# EAGLE design arduino_shield_v2 (EAGLE 9.6.2)
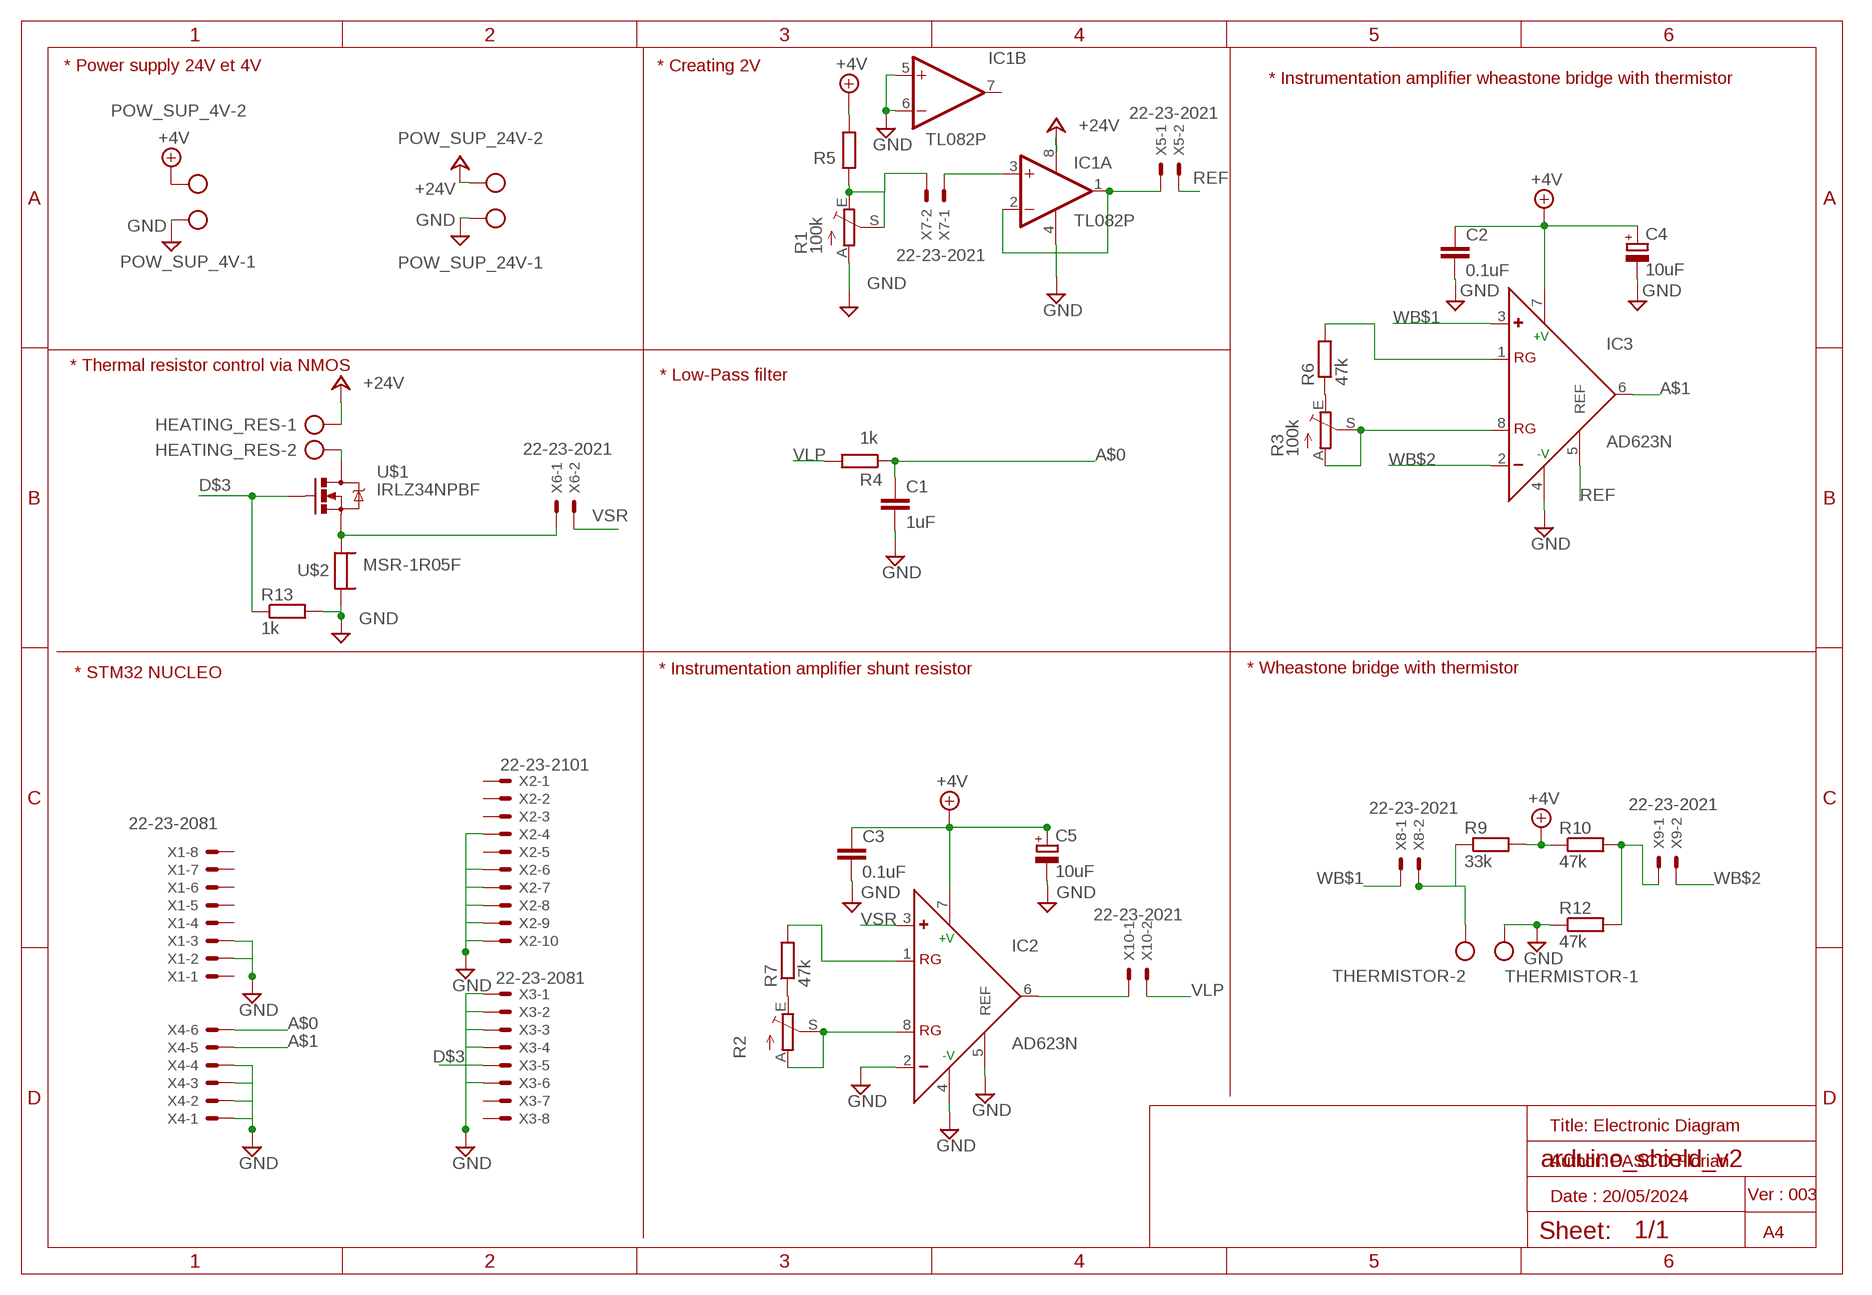
[diagram p0: schematic, sheet 1]

## Parts
C1  1uF  C-EU050-025X075  [C050-025X075]
C2  0.1uF  C-EU050-025X075  [C050-025X075]
C3  0.1uF  C-EU050-025X075  [C050-025X075]
C4  10uF  CPOL-EUE5-5  [E5-5]
C5  10uF  CPOL-EUE5-5  [E5-5]
HEATING_RES  AK300/2  [AK300/2]
IC1  TL082P  [DIL08]
IC2  AD623N  [DIL08]
IC3  AD623N  [DIL08]
POW_SUP_4V  AK300/2  [AK300/2]
POW_SUP_24V  AK300/2  [AK300/2]
R1  100k  TRIM_EU-S64W  [S64W]
R2  TRIM_EU-S64W  [S64W]
R3  100k  TRIM_EU-S64W  [S64W]
R4  1k  R-EU_0207/10  [0207/10]
R5  47k  R-EU_0207/10  [0207/10]
R6  47k  R-EU_0207/10  [0207/10]
R7  47k  R-EU_0207/10  [0207/10]
R9  33k  R-EU_0207/10  [0207/10]
R10  47k  R-EU_0207/10  [0207/10]
R12  47k  R-EU_0207/10  [0207/10]
R13  1k  R-EU_0207/10  [0207/10]
THERMISTOR  AK300/2  [AK300/2]
U$1  IRLZ34NPBF  [TO-220(2)]
U$2  MSR-1R05F  [MSR1]
X1  22-23-2081  [22-23-2081]
X2  22-23-2101  [22-23-2101]
X3  22-23-2081  [22-23-2081]
X4  22-23-2061  [22-23-2061]
X5  22-23-2021  [22-23-2021]
X6  22-23-2021  [22-23-2021]
X7  22-23-2021  [22-23-2021]
X8  22-23-2021  [22-23-2021]
X9  22-23-2021  [22-23-2021]
X10  22-23-2021  [22-23-2021]

## Nets
+4.1V: C2.1 C3.1 C4.+ C5.+ IC2.7(+V) IC3.7(+V) POW_SUP_4V.2 R5.2 R9.2 R10.1 ; supply symbol labelled +4V
+24V: HEATING_RES.1 IC1.8(P:V+) POW_SUP_24V.2
A$0: C1.1 R4.1 X4.6
A$1: IC3.6(OUT) X4.5
D$3: R13.1 U$1.IN(G) X3.5
GND: C1.2 C2.2 C3.2 C4.- C5.- IC1.4(P:V-) IC1.5(B:+IN) IC1.6(B:-IN) IC2.2(-) IC2.4(-V) IC2.5(REF) IC3.4(-V) POW_SUP_4V.1 POW_SUP_24V.1 R1.A R12.1 R13.2 THERMISTOR.1 U$2.P$2 X1.2 X1.3 X2.4 X2.6 X2.7 X2.8 X2.9 X2.10 X3.1 X3.2 X3.3 X3.4 X3.6 X4.1 X4.2 X4.3 X4.4
N$1: R1.E R1.S R5.1 X7.2
N$2: R2.E R7.1
N$3: IC3.1(RG) R6.2
N$4: IC3.8(RG) R3.A R3.S
N$5: IC2.8(RG) R2.A R2.S
N$6: R3.E R6.1
N$7: IC2.1(RG) R7.2
N$8: IC1.3(A:+IN) X7.1
N$9: IC2.6(OUT) X10.1
N$10: HEATING_RES.2 U$1.GND(D)
N$11: R10.2 R12.2 X9.1
N$12: R9.1 THERMISTOR.2 X8.2
N$13: IC1.1(A:OUT) IC1.2(A:-IN) X5.1
N$14: U$1.OUT(S) U$2.P$1 X6.1
REF: IC3.5(REF) X5.2
VLP: R4.2 X10.2
VSR: IC2.3(+) X6.2
WB$1: IC3.3(+) X8.1
WB$2: IC3.2(-) X9.2
Unconnected: IC1.7(B:OUT) X1.1 X1.4 X1.5 X1.6 X1.7 X1.8 X2.1 X2.2 X2.3 X2.5 X3.7 X3.8

## Notes on the sheet
- * Power supply 24V et 4V | * Creating 2V
- * Instrumentation amplifier wheastone bridge with thermistor
- * Thermal resistor control via NMOS
- * Low-Pass filter
- * STM32 NUCLEO | * Instrumentation amplifier shunt resistor | * Wheastone bridge with thermistor
- Title: Electronic Diagram
- Author: PASCO Florian
- Date : 20/05/2024 | Ver : 003
- A4

## Library data of the parts
C1-C3 = rcl:C-EU: CAPACITOR, European symbol; SPICEPREFIX: C
C4 C5 = rcl:CPOL-EU: POLARIZED CAPACITOR, European symbol; SPICEPREFIX: C
HEATING_RES POW_SUP_4V POW_SUP_24V THERMISTOR = con-ptr500:AK300/2: CONNECTOR; OC_FARNELL: unknown; OC_NEWARK: unknown
IC1 = linear:TL082: OP AMP Data sheet <http://www.ti.com/lit/ds/symlink/tl084a . pdf>; DATA_SHEET: <a href="http://www.ti.com/lit/ds/symlink/tl084a.pdf"> Data sheet </a>
IC2 IC3 = analog-devices:AD623: Single-Supply, Rail-to-Rail, Low Cost Instrumentation Amplifier Source: http://www.analog.com/static/imported-files/data_sheets/AD623.pdf; MF: ALTERA CORPORATION; MPN: AD623ANZ; OC_FARNELL: 9603700; OC_NEWARK: 59K4402
R1-R3 = pot:TRIM_EU-: POTENTIOMETER
R4-R7 R9 R10 R12 R13 = rcl:R-EU_: RESISTOR, European symbol; SPICEPREFIX: R
U$1 = IRLZ34NPBF:IRLZ34NPBF: Check availability <https://pricing.snapeda.com/parts/IRLZ34NPBF/Infineon/view-part?ref=eda>; AVAILABILITY: In Stock; CHECK_PRICES: https://www.snapeda.com/parts/IRLZ34NPBF/Infineon+Technologies/view-part/?ref=eda; DESCRIPTION: MOSFET, Power,N-Ch,VDSS 55V,RDS(ON) 0.035Ohm,ID 30A,TO-220AB,PD 68W,VGS +/-16V | Infineon IRLZ34NPBF; MF: Infineon; MP: IRLZ34NPBF; PACKAGE: TO-220 Infineon; PRICE: None; PURCHASE-URL: https://www.snapeda.com/api/url_track_click_mouser/?unipart_id=219&manufacturer=Infineon&part_name=IRLZ34NPBF&search_term=None; SNAPEDA_LINK: https://www.snapeda.com/parts/IRLZ34NPBF/Infineon+Technologies/view-part/?ref=snap
U$2 = MSR-1R05F:MSR-1R05F
X1 X3 = con-molex:22-23-2081: .100" (2.54mm) Center Header - 8 Pin; MF: MOLEX; MPN: 22-23-2081; OC_FARNELL: 1756826; OC_NEWARK: 01C7592
X2 = con-molex:22-23-2101: .100" (2.54mm) Center Header - 10 Pin; MF: MOLEX; MPN: 22-23-2101; OC_FARNELL: 1756828; OC_NEWARK: 94C0765
X4 = con-molex:22-23-2061: .100" (2.54mm) Center Header - 6 Pin; MF: MOLEX; MPN: 22-23-2061; OC_FARNELL: 1462922; OC_NEWARK: 27C1933
X5-X10 = con-molex:22-23-2021: .100" (2.54mm) Center Header - 2 Pin; MF: MOLEX; MPN: 22-23-2021; OC_FARNELL: 1462926; OC_NEWARK: 25C3832

## Board
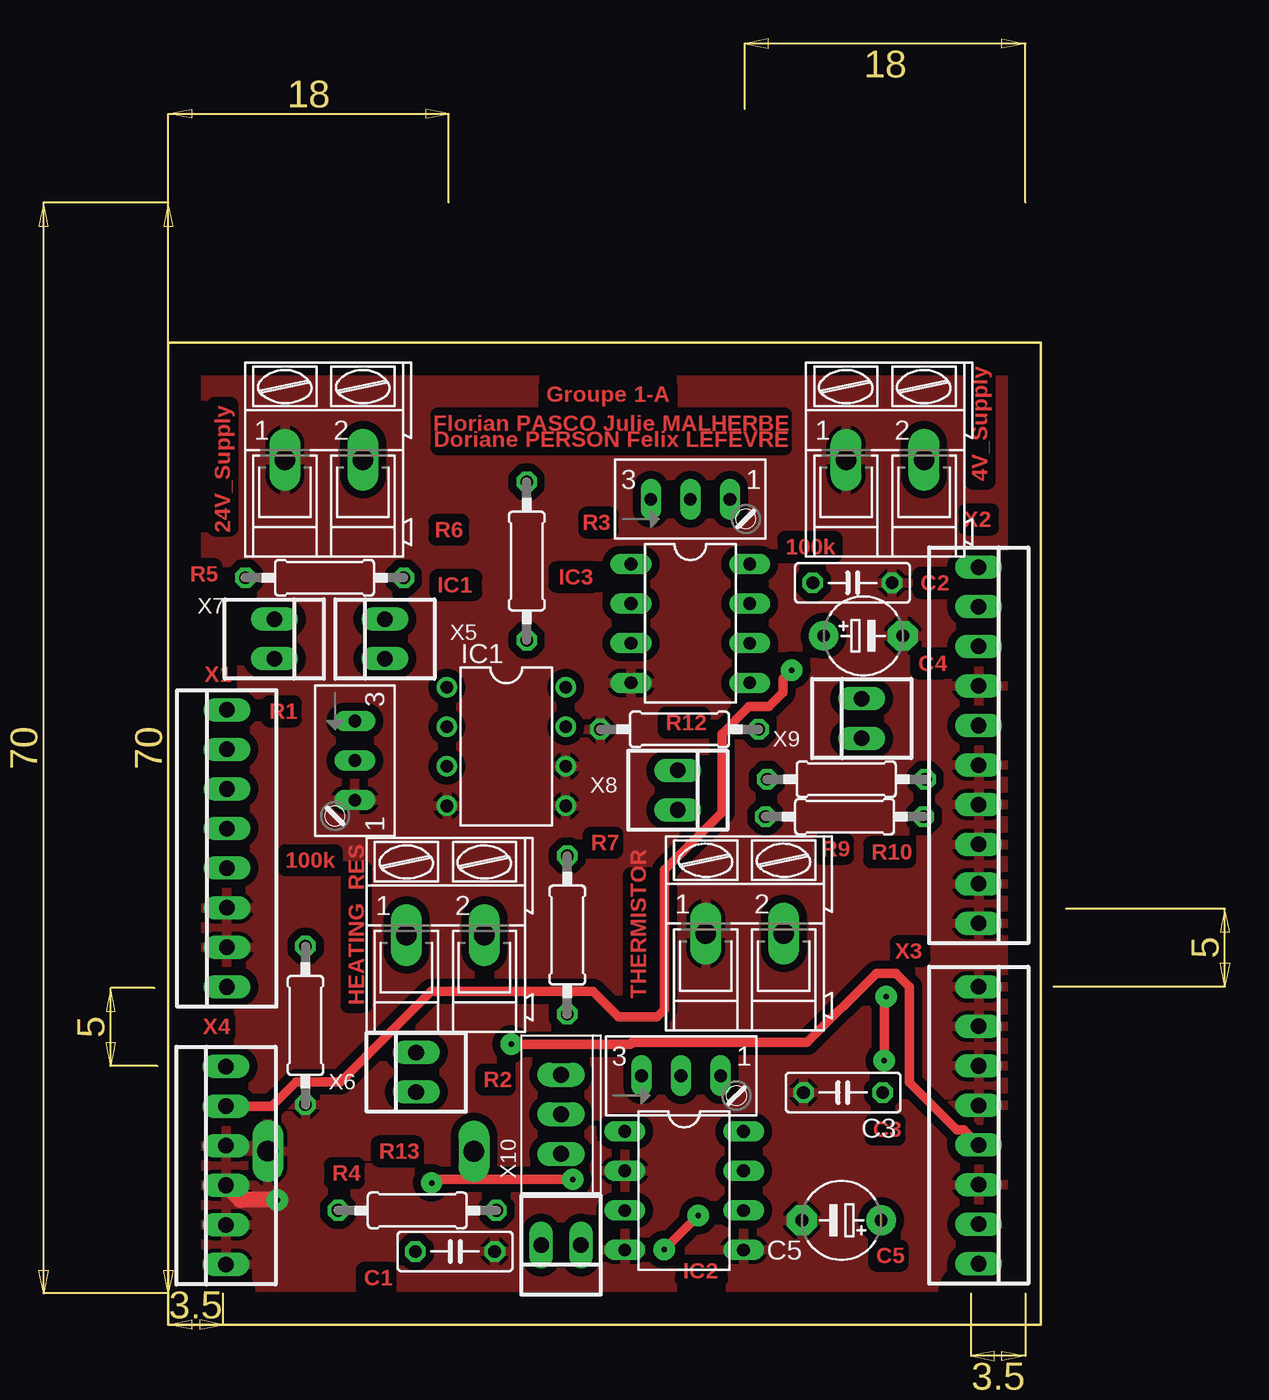
[diagram p1: board, top side]
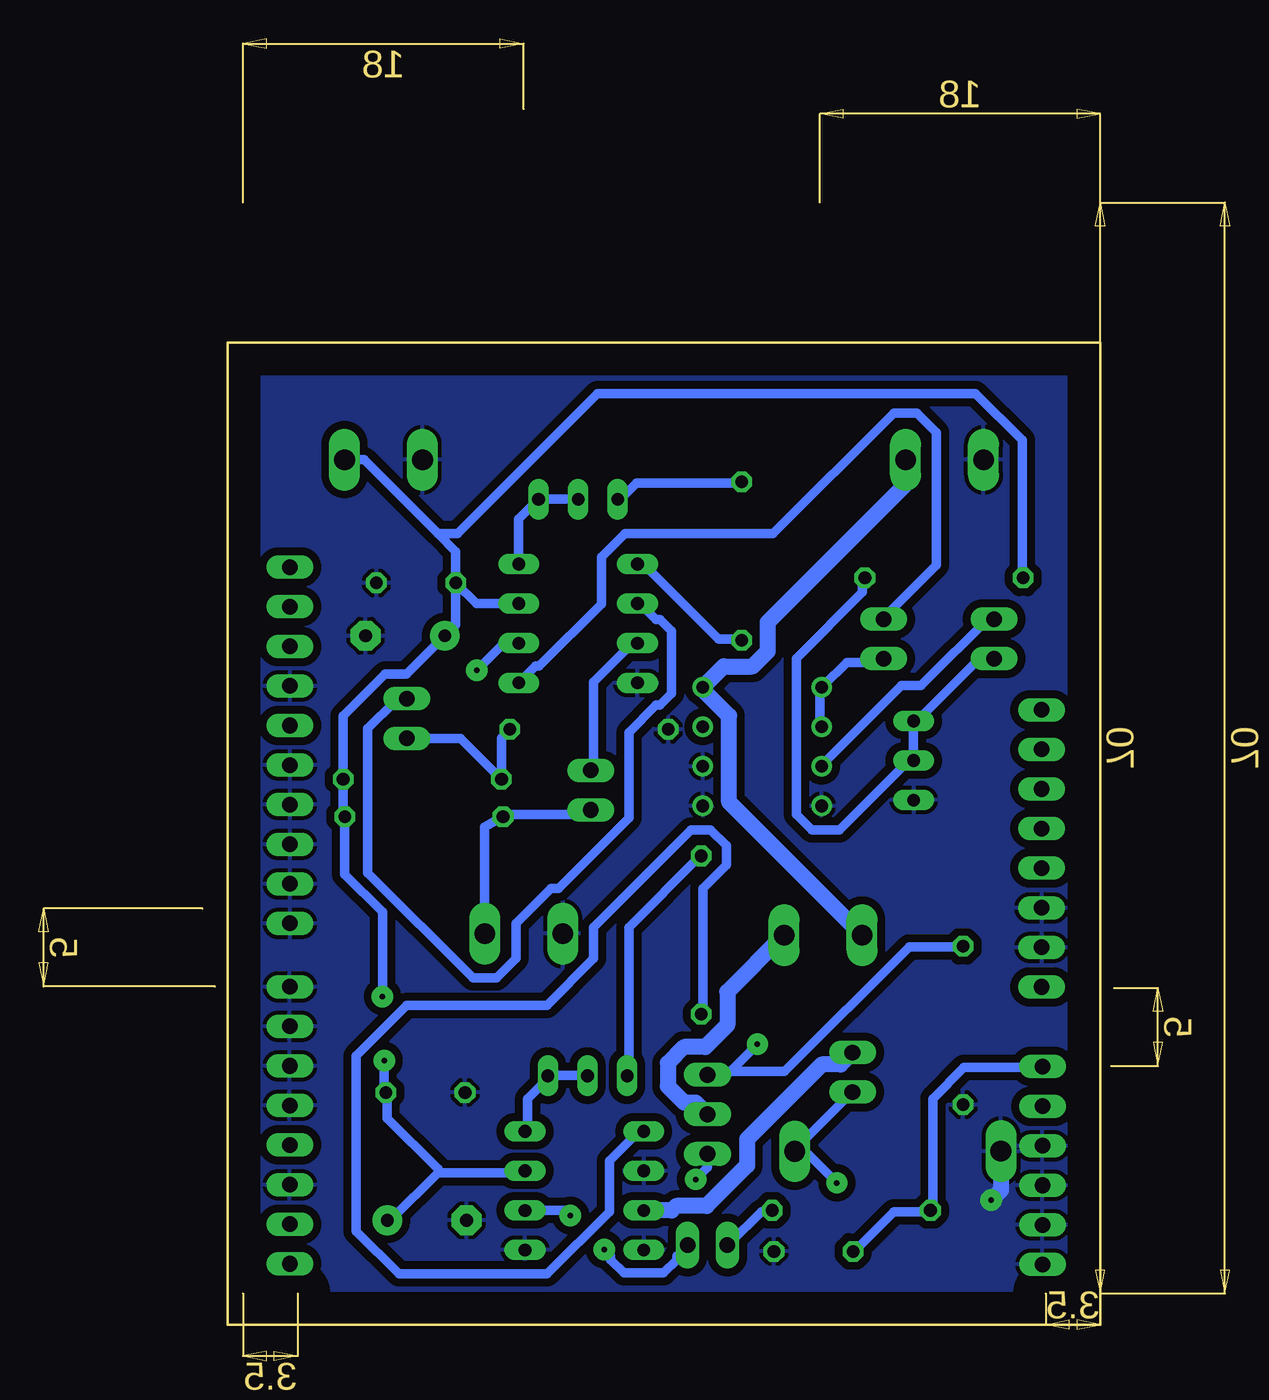
[diagram p2: board, bottom side, seen from below]

Size 56 x 63 mm. Coordinates in mm from the lower left corner, seen from the top.
Outline: 0,0 0,63 56,63 56,0 0,0
Copper layers (1*16): Top 0.035mm / dielectric 1.5mm / Bottom 0.035mm
Design rules "LBMS-ENIB": minimum track width 24mil, minimum drill 10mil, track to track 20mil, track to pad 20mil, pad to pad 20mil, via to via 20mil, smd to smd 8mil, copper to edge 80mil, drill to drill 8mil, minimum pad ring 10mil, minimum via ring 20mil, stop-mask expansion 4mil, vias tented up to drill 0mil, thermal gap 10mil

### Footprints (pad centres in the part's own frame; a part is rotated, then mirrored left to right if it is on the bottom)
C050-025X075 = drill 0.813 octagon: 1 -2.54,0; 2 2.54,0
E5-5 = drill 0.813 pad 1.905: + -2.54,0 | drill 0.813 pad 1.905 octagon: - 2.54,0
AK300/2 = drill 1.321 long: 1 -2.515,0; 2 2.489,0
DIL08 = drill 0.813 pad 1.27: 1 -3.81,-3.81; 2 -1.27,-3.81; 3 1.27,-3.81; 4 3.81,-3.81; 5 3.81,3.81; 6 1.27,3.81; 7 -1.27,3.81; 8 -3.81,3.81
DIL08' = drill 0.813 long: 1 -3.81,-3.81; 2 -1.27,-3.81; 3 1.27,-3.81; 4 3.81,-3.81; 5 3.81,3.81; 6 1.27,3.81; 7 -1.27,3.81; 8 -3.81,3.81
S64W = drill 0.813 long: A 2.54,1.27; E -2.54,1.27; S 0,1.27
0207/10 = drill 0.813 octagon: 1 -5.08,0; 2 5.08,0
TO-220(2) = drill 1.016 long: GND 0,0; IN -2.54,0; OUT 2.54,0
MSR1 = drill 1.321 long: P$1 -6.74,0; P$2 6.5,-0.01
22-23-2081 = drill 1 long: 1 -8.89,0; 2 -6.35,0; 3 -3.81,0; 4 -1.27,0; 5 1.27,0; 6 3.81,0; 7 6.35,0; 8 8.89,0
22-23-2101 = drill 1 long: 1 -11.43,0; 2 -8.89,0; 3 -6.35,0; 4 -3.81,0; 5 -1.27,0; 6 1.27,0; 7 3.81,0; 8 6.35,0; 9 8.89,0; 10 11.43,0
22-23-2061 = drill 1 long: 1 -6.35,0; 2 -3.81,0; 3 -1.27,0; 4 1.27,0; 5 3.81,0; 6 6.35,0
22-23-2021 = drill 1 long: 1 -1.27,0; 2 1.27,0

### Placement (x,y rotation side)
C1  18.4,4.7 0 top
C2  43.9,47.6 0 top
C3  43.3,14.9 180 top
C4  44.6,44.2 0 top
C5  43.2,6.7 180 top
HEATING_RES  17.8,25 0 top
IC1  21.69,37.1 270 top
IC2  AD623N  [DIL08']  33.1,8.6 270 top
IC3  AD623N  [DIL08']  33.5,45 270 top
POW_SUP_4V  46,55.5 0 top
POW_SUP_24V  10,55.5 0 top
R1  10.7,36.2 270 top
R2  32.9,14.7 0 top
R3  33.5,51.7 0 top
R4  15.98,7.34 0 top
R5  10.02,47.93 180 top
R6  23,49 270 top
R7  25.6,25 270 top
R9  43.4,32.6 0 top
R10  43.5,35 180 top
R12  32.8,38.2 0 top
R13  8.8,19.2 270 top
THERMISTOR  37,25.1 0 top
U$1  25.2,13.5 270 top
U$2  12.88,11.12 180 top
X1  3.75,30.56 90 top
X2  52,37.18 270 top
X3  52.01,12.8 270 top
X4  3.7,10.21 90 top
X5  13.9,44 90 top
X6  15.9,16.2 90 top
X7  6.8,44 270 top
X8  32.7,34.3 270 top
X9  44.5,38.9 90 top
X10  25.2,5.1 180 top

### Tracks (layer width: path | path; a pad name or v marks a point on that pad's centre or on a via)
+4.1V  (via drill 0.35)
  Top 0.61: v46.06,21.06 45.94,20.94 v45.94,16.94
  Bottom 0.61: 42.5,9.75 37,9.75 IC2.7 | 42.5,9.75 45.5,6.75 C5.+ | 45.75,14.75 45.75,13.25 42.5,10 42.5,9.75 | 45.75,14.75 C3.1 | R5.2 5,48 5,56.75 8,59.75 32.25,59.75 41.25,50.75 42.5,50.75 | POW_SUP_4V.2 47.25,55.5 42.5,50.75 | v46.06,21.06 46.06,26.48 48.48,28.9 R9.2 48.58,32.7 R10.1 48.58,39.06 45.9,41.74 44.52,41.74 C4.+ 41.36,44.9 C2.1 | v45.94,16.94 45.94,14.94 45.75,14.75 | C2.1 40.03,46.27 IC3.7 | C2.1 41.36,49.61 42.5,50.75
+24V
  Bottom 1.016: HEATING_RES.1 23.82,33.54 23.82,39.06 25.5,40.74 IC1.8 24.16,42.24 22.31,42.24 21.32,43.23 21.32,45.08 12.49,53.92 POW_SUP_24V.2
A$0
  Bottom 0.61: C1.1 15.75,4.75 13.25,7.25 11,7.25 R4.1 10.75,7.5 10.75,14.5 8.75,16.5 3.75,16.5 X4.6
A$1  (via drill 0.35)
  Top 0.61: v40,42 39.44,41.44 39.44,40.58 38.54,39.67 37.27,39.67 35.51,37.92 35.51,32.87 31.83,29.19 31.83,20.23 31.36,19.76 28.88,19.76 27.25,21.39 16.85,21.39 11.05,15.59 8.19,15.59 6.62,14.02 X4.5
  Bottom 0.61: IC3.6 38.27,43.73 v40,42
D$3  (via drill 0.35)
  Top 0.61: v22,18 29.65,18 29.75,18.1 40.99,18.1 45.44,22.55 46.68,22.55 47.55,21.68 47.55,15.55 50.6,12.5 51.03,12.5 X3.5
  Bottom 0.61: R13.1 9,24.25 12.25,24.25 20.25,16.25 25,16.25 U$1.IN 23.96,16.04 v22,18
GND  (via drill 0.35)
  Top 1.016: v7,8 4.64,8 X4.3
  Bottom 1.016: U$2.P$2 6.38,8.62 v7,8
  pour Top: 22.82,90.56 65.56,90.56 65.9,90.9 80.03,76.77 80.03,-7.38 59,-28.42 -13.07,-28.42 -32.52,-8.96 -32.52,74.86 -16.87,90.51 23.57,90.51
  pour Bottom: -5,-3 -5,67 60,67 60,-3
N$1
  Bottom 0.61: R5.1 15.25,47.75 15.25,47 19.5,42.75 19.5,32.75 18.5,31.75 16.75,31.75 12.25,36.25 R1.S 12,36.25 12,38.5 R1.E 11.75,38.75 8,42.5 7,42.5 X7.2
N$2
  Bottom 0.61: R2.E 30.25,16 30.25,25.5 25.75,30 R7.1
N$3
  Bottom 0.61: R6.2 23,44 24.5,44 29.5,49 IC3.1
N$4
  Bottom 0.61: R3.S R3.A 37.31,51.7 IC3.8
N$5
  Bottom 0.61: R2.S 33,16 35.25,16 R2.A 35.5,15.75 36.75,14.5 36.75,12.5 IC2.8
N$6
  Bottom 0.61: R6.1 23,54 29.75,54 30.75,53 R3.E
N$7
  Bottom 0.61: R7.2 25.5,20 25.5,28 24,29.5 24,30.75 25,31.75 26.25,31.75 32.5,25.5 32.5,23.5 35.5,20.5 44.5,20.5 47.75,17.25 47.75,6 45,3.25 35.5,3.25 31.5,7.25 31.5,10.5 29.5,12.5 IC2.1
N$8
  Bottom 0.61: IC1.3 17.75,36 12.75,41 11.5,41 7,45.5 X7.1
N$9  (via drill 0.35)
  Top 0.61: v34,7 v31.82,4.82
  Bottom 0.61: IC2.6 34.33,7.33 v34,7 | v31.82,4.82 31.42,4.42 31.42,4.18 30.56,3.32 28.02,3.32 27.16,4.18 27.16,4.41 X10.1
N$10
  Bottom 1.016: HEATING_RES.2 23.92,21.37 23.92,19.23 25.33,17.82 26.7,17.82 27.74,16.78 27.74,15.3 26.7,14.26 25.96,14.26 U$1.GND
N$11
  Bottom 0.61: X9.1 41.05,37.63 R10.2 38.42,37.66 R12.2
N$12
  Bottom 0.61: X8.2 32.75,33 33,32.75 38.25,32.75 R9.1 39.5,31.94 39.5,25.25 THERMISTOR.2
N$13
  Bottom 0.61: IC1.2 18,38.5 18,40.75 IC1.1 17.75,41 16.25,42.5 14,42.5 X5.1
N$14  (via drill 0.35)
  Top 0.61: v25.96,9.32 17.12,9.32 v16.9,9.1
  Bottom 0.61: X6.1 19.61,11.21 U$2.P$1 18.92,11.12 v16.9,9.1 | U$1.OUT 25.2,10.09 v25.96,9.32
REF
  Bottom 0.61: IC3.5 36.25,42.25 36,42.25 32,46.25 32,49.25 30.5,50.75 21,50.75 13.25,58.5 11.75,58.5 10.5,57.25 10.5,48.75 13.75,45.5 X5.2
VLP
  Bottom 0.61: R4.2 21.25,7.25 21.75,7.25 23.75,5.25 X10.2
VSR
  Bottom 1.016: X6.2 16.67,16.7 17.87,16.7 22.66,11.91 22.66,10.22 25.26,7.62 27.2,7.62 27.5,7.33 IC2.3
WB$1
  Bottom 0.61: IC3.3 29.75,43.5 30.25,43.5 32.5,41.25 32.5,35.75 X8.1
WB$2
  Bottom 0.61: IC3.2 29.5,46.25 28.5,45.25 28.25,45.25 27.5,44.5 27.5,40.5 28.25,39.75 28.5,39.75 30.25,38 30.25,32.5 34.75,28 35.25,28 37.5,25.75 37.5,23.5 38.75,22.25 40.25,22.25 47,29 47,38.25 45.25,40 44.5,40 X9.2

### Text on the board
Top: Groupe 1-A | 24V_Supply | Florian PASCO Julie MALHERBE / Doriane PERSON Felix LEFEVRE | 4V_Supply | R3 | X2 | R6 | 100k | R5 | IC3 | IC1 | C2 | C4 | X1 | R1 | R12 | 100k | R7 | R9 | R10 | X3 | HEATING_RES | THERMISTOR | X4 | R2 | C3 | R13 | R4 | C5 | IC2 | C1